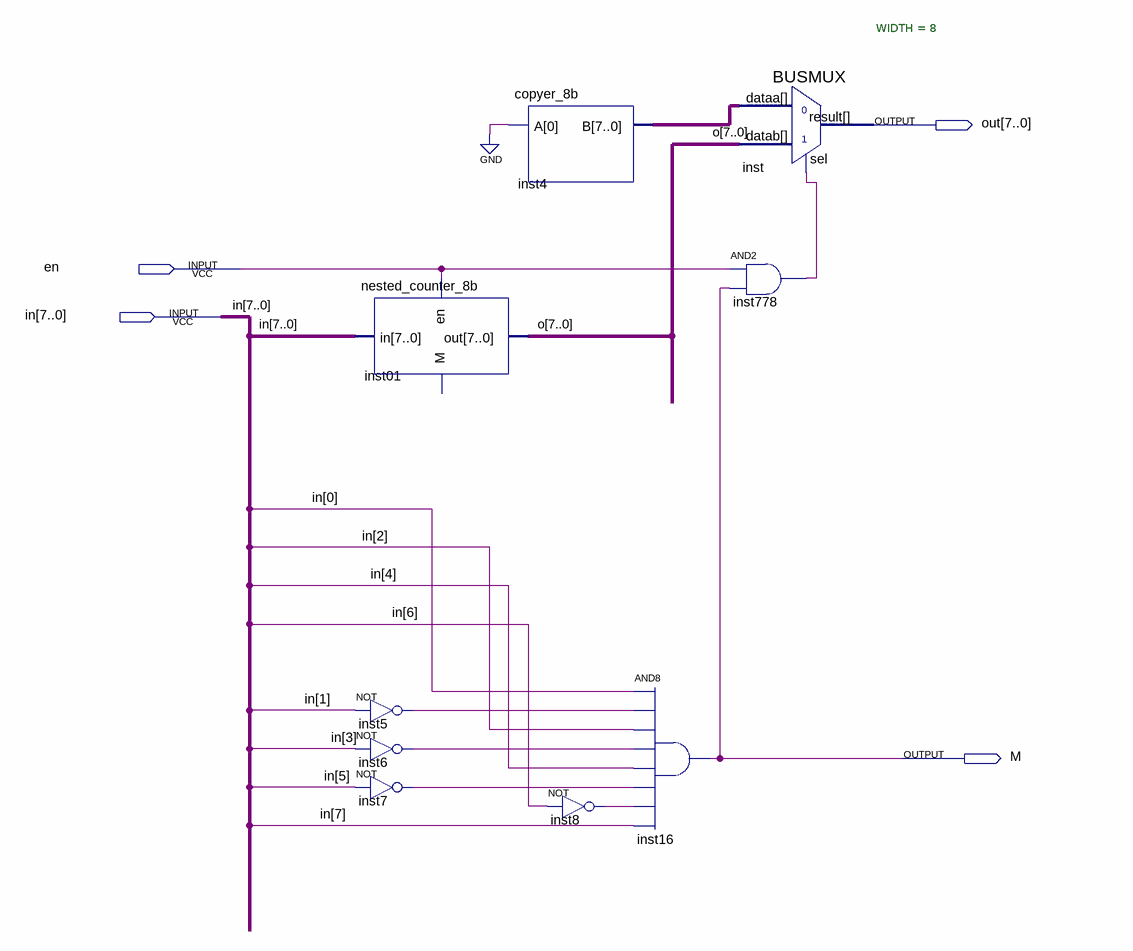
[diagram p0: schematic sheet]
// Quartus schematic nested_counter_150d.bdf as structural Verilog: 9 symbols, 4 pins
module nested_counter_150d (
  input  en,
  input  [7:0] in,
  output [7:0] out,
  output M
);

  wire inst5_out, inst6_out, inst7_out, inst8_out, inst778_out;
  wire [7:0] inst4_b, o;

  nested_counter_8b inst01 (.en(en), .in(in), .out(o));  // open: M
  not inst5 (inst5_out, in[1]);
  not inst6 (inst6_out, in[3]);
  not inst7 (inst7_out, in[5]);
  copyer_8b inst4 (.A(1'b0), .B(inst4_b));
  not inst8 (inst8_out, in[6]);
  and inst16 (M, in[0], inst5_out, in[2], inst6_out, in[4], inst7_out, inst8_out, in[7]);
  and inst778 (inst778_out, en, M);
  BUSMUX #(.WIDTH(8)) inst (.datab(o), .sel(inst778_out), .dataa(inst4_b), .result(out));
endmodule
